# Altium project mezza.PrjPcb
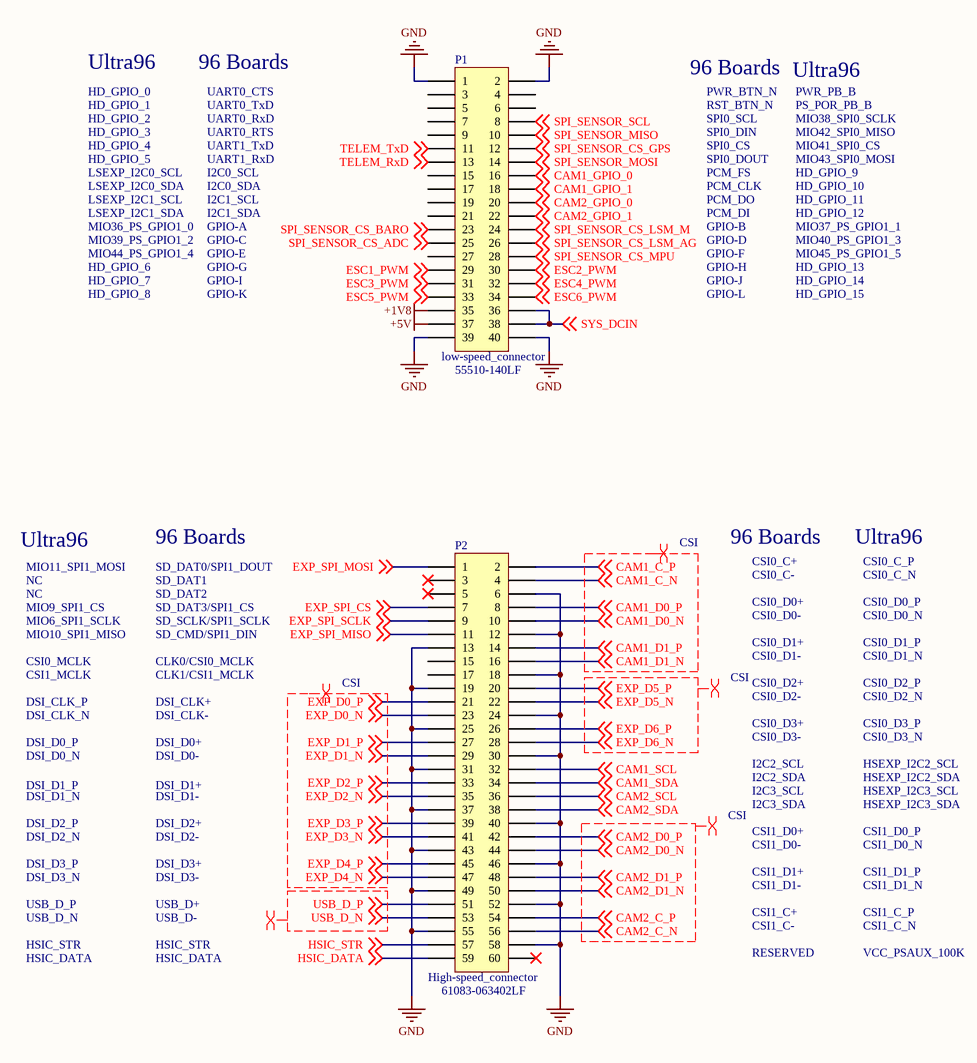
[diagram p0: mezza.SchDoc]
5 sheets, 47 parts. Net scope: flat (ports and power ports of the same name join across sheets).
Board file: mezza.PcbDoc
Sheets:
  mezza.SchDoc
  Camera.SchDoc
  9DOF_Sensors.SchDoc
  GPS.SchDoc
  esc.SchDoc

## Sheet mezza.SchDoc
size A1

### Parts
(Parts that share a designator on the sheet are numbered #1, #2 ... from top to bottom, then left to right.)
P1#1  low-speed_connector  PartNumber: 55510-140LF  [low-speed_connector_SM]
P2#1  High-speed_connector  PartNumber: 61083-063402LF  [high-speed_connector]

### Nets
+1V8: P1#1.35
+5V: P1#1.37
GND: P1#1.1 P1#1.2 P1#1.39 P1#1.40 P2#1.6 P2#1.12 P2#1.13 P2#1.18 P2#1.19 P2#1.24 P2#1.25 P2#1.30 P2#1.31 P2#1.37 P2#1.40 P2#1.43 P2#1.46 P2#1.49 P2#1.52 P2#1.55 P2#1.58
CAM1_C_N: P2#1.4 ; off-sheet CAM1_C_N
CAM1_C_P: P2#1.2 ; off-sheet CAM1_C_P
CAM1_D0_N: P2#1.10 ; off-sheet CAM1_D0_N
CAM1_D0_P: P2#1.8 ; off-sheet CAM1_D0_P
CAM1_D1_N: P2#1.16 ; off-sheet CAM1_D1_N
CAM1_D1_P: P2#1.14 ; off-sheet CAM1_D1_P
CAM1_GPIO_0: P1#1.16 ; off-sheet CAM1_GPIO_0
CAM1_GPIO_1: P1#1.18 ; off-sheet CAM1_GPIO_1
CAM1_SCL: P2#1.32 ; off-sheet CAM1_SCL
CAM1_SDA: P2#1.34 ; off-sheet CAM1_SDA
CAM2_C_N: P2#1.56 ; off-sheet CAM2_C_N
CAM2_C_P: P2#1.54 ; off-sheet CAM2_C_P
CAM2_D0_N: P2#1.44 ; off-sheet CAM2_D0_N
CAM2_D0_P: P2#1.42 ; off-sheet CAM2_D0_P
CAM2_D1_N: P2#1.50 ; off-sheet CAM2_D1_N
CAM2_D1_P: P2#1.48 ; off-sheet CAM2_D1_P
CAM2_GPIO_0: P1#1.20 ; off-sheet CAM2_GPIO_0
CAM2_GPIO_1: P1#1.22 ; off-sheet CAM2_GPIO_1
CAM2_SCL: P2#1.36 ; off-sheet CAM2_SCL
CAM2_SDA: P2#1.38 ; off-sheet CAM2_SDA
ESC1_PWM: P1#1.29 ; off-sheet ESC1_PWM
ESC2_PWM: P1#1.30 ; off-sheet ESC2_PWM
ESC3_PWM: P1#1.31 ; off-sheet ESC3_PWM
ESC4_PWM: P1#1.32 ; off-sheet ESC4_PWM
ESC5_PWM: P1#1.33 ; off-sheet ESC5_PWM
ESC6_PWM: P1#1.34 ; off-sheet ESC6_PWM
EXP_D0_N: P2#1.23 ; off-sheet EXP_D0_N
EXP_D0_P: P2#1.21 ; off-sheet EXP_D0_P
EXP_D1_N: P2#1.29 ; off-sheet EXP_D1_N
EXP_D1_P: P2#1.27 ; off-sheet EXP_D1_P
EXP_D2_N: P2#1.35 ; off-sheet EXP_D2_N
EXP_D2_P: P2#1.33 ; off-sheet EXP_D2_P
EXP_D3_N: P2#1.41 ; off-sheet EXP_D3_N
EXP_D3_P: P2#1.39 ; off-sheet EXP_D3_P
EXP_D4_N: P2#1.47 ; off-sheet EXP_D4_N
EXP_D4_P: P2#1.45 ; off-sheet EXP_D4_P
EXP_D5_N: P2#1.22 ; off-sheet EXP_D5_N
EXP_D5_P: P2#1.20 ; off-sheet EXP_D5_P
EXP_D6_N: P2#1.28 ; off-sheet EXP_D6_N
EXP_D6_P: P2#1.26 ; off-sheet EXP_D6_P
EXP_SPI_CS: P2#1.7 ; off-sheet EXP_SPI_CS
EXP_SPI_MISO: P2#1.11 ; off-sheet EXP_SPI_MISO
EXP_SPI_MOSI: P2#1.1 ; off-sheet EXP_SPI_MOSI
EXP_SPI_SCLK: P2#1.9 ; off-sheet EXP_SPI_SCLK
HSIC_DATA: P2#1.59 ; off-sheet HSIC_DATA
HSIC_STR: P2#1.39(57) ; off-sheet HSIC_STR
SPI_SENSOR_CS_ADC: P1#1.25 ; off-sheet SPI_SENSOR_CS_ADC
SPI_SENSOR_CS_BARO: P1#1.23 ; off-sheet SPI_SENSOR_CS_BARO
SPI_SENSOR_CS_GPS: P1#1.12 ; off-sheet SPI_SENSOR_CS_GPS
SPI_SENSOR_CS_LSM_AG: P1#1.26 ; off-sheet SPI_SENSOR_CS_LSM_AG
SPI_SENSOR_CS_LSM_M: P1#1.24 ; off-sheet SPI_SENSOR_CS_LSM_M
SPI_SENSOR_CS_MPU: P1#1.28 ; off-sheet SPI_SENSOR_CS_MPU
SPI_SENSOR_MISO: P1#1.10 ; off-sheet SPI_SENSOR_MISO
SPI_SENSOR_MOSI: P1#1.14 ; off-sheet SPI_SENSOR_MOSI
SPI_SENSOR_SCL: P1#1.8 ; off-sheet SPI_SENSOR_SCL
SYS_DCIN: P1#1.36 P1#1.38 ; off-sheet SYS_DCIN
TELEM_RxD: P1#1.13 ; off-sheet TELEM_RxD
TELEM_TxD: P1#1.11 ; off-sheet TELEM_TxD
USB_D_N: P2#1.53 ; off-sheet USB_D_N
USB_D_P: P2#1.51 ; off-sheet USB_D_P

Not connected (* = marked no-connect by the designer): P1#1 3 4 5 6 7 9 15 17 19 21 27; P2#1 3* 5* 15 17

### Layout directives
differential pair; rule Differential Pairs Routing [Pref Gap = 0.15mm    Min Gap  = 0.1mm    Max Gap  = 0.254mmPref Width = 0.15mm    Min Width  = 0.1mm    Max Width  = 0.381mm]; differential pair class CSI: CAM1_C_N, CAM1_C_P, CAM1_D0_N, CAM1_D0_P, CAM1_D1_N, CAM1_D1_P, CAM2_C_N, CAM2_C_P, CAM2_D0_N, CAM2_D0_P, CAM2_D1_N, CAM2_D1_P, EXP_D0_N, EXP_D0_P, EXP_D1_N, EXP_D1_P, EXP_D2_N, EXP_D2_P, EXP_D3_N, EXP_D3_P, EXP_D4_N, EXP_D4_P, EXP_D5_N, EXP_D5_P, EXP_D6_N, EXP_D6_P
differential pair: USB_D_N, USB_D_P

### Notes on the sheet
- Ultra96
- 96 Boards
- HD_GPIO_0
- HD_GPIO_1
- HD_GPIO_2
- HD_GPIO_3
- HD_GPIO_4
- UART0_CTS
- UART0_TxD
- UART0_RxD
- UART0_RTS
- UART1_TxD
- PWR_BTN_N
- RST_BTN_N
- SPI0_SCL
- SPI0_DIN
- SPI0_CS
- PWR_PB_B
- PS_POR_PB_B
- MIO38_SPI0_SCLK
- MIO42_SPI0_MISO
- MIO41_SPI0_CS
- HD_GPIO_5
- LSEXP_I2C0_SCL
- LSEXP_I2C0_SDA
- LSEXP_I2C1_SCL
- LSEXP_I2C1_SDA
- UART1_RxD
- I2C0_SCL
- I2C0_SDA
- I2C1_SCL
- I2C1_SDA
- SPI0_DOUT
- PCM_FS
- PCM_CLK
- PCM_DO
- PCM_DI
- MIO43_SPI0_MOSI
- HD_GPIO_9
- HD_GPIO_10
- HD_GPIO_11
- HD_GPIO_12
- MIO36_PS_GPIO1_0
- MIO39_PS_GPIO1_2
- MIO44_PS_GPIO1_4
- HD_GPIO_6
- HD_GPIO_7
- GPIO-A
- GPIO-C
- GPIO-E
- GPIO-G
- GPIO-I
- GPIO-B
- GPIO-D
- GPIO-F
- GPIO-H
- GPIO-J
- MIO37_PS_GPIO1_1
- MIO40_PS_GPIO1_3
- MIO45_PS_GPIO1_5
- HD_GPIO_13
- HD_GPIO_14
- HD_GPIO_8
- GPIO-K
- GPIO-L
- HD_GPIO_15
- MIO11_SPI1_MOSI
- NC
- MIO9_SPI1_CS
- SD_DAT0/SPI1_DOUT
- SD_DAT1
- SD_DAT2
- SD_DAT3/SPI1_CS
- CSI0_C+
- CSI0_C-
- CSI0_D0+
- CSI0_D0-
- CSI0_C_P
- CSI0_C_N
- CSI0_D0_P
- CSI0_D0_N
- MIO6_SPI1_SCLK
- MIO10_SPI1_MISO
- CSI0_MCLK
- CSI1_MCLK
- SD_SCLK/SPI1_SCLK
- SD_CMD/SPI1_DIN
- CLK0/CSI0_MCLK
- CLK1/CSI1_MCLK
- CSI0_D1+
- CSI0_D1-
- CSI0_D2+
- CSI0_D1_P
- CSI0_D1_N
- CSI0_D2_P
- DSI_CLK_P
- DSI_CLK_N
- DSI_D0_P
- DSI_CLK+
- DSI_CLK-
- DSI_D0+
- CSI0_D2-
- CSI0_D3+
- CSI0_D3-
- CSI0_D2_N
- CSI0_D3_P
- CSI0_D3_N
- DSI_D0_N
- DSI_D1_P
- DSI_D1_N
- DSI_D0-
- DSI_D1+
- DSI_D1-
- I2C2_SCL
- I2C2_SDA
- I2C3_SCL
- I2C3_SDA
- HSEXP_I2C2_SCL
- HSEXP_I2C2_SDA
- HSEXP_I2C3_SCL
- HSEXP_I2C3_SDA
- DSI_D2_P
- DSI_D2_N
- DSI_D3_P
- DSI_D3_N
- DSI_D2+
- DSI_D2-
- DSI_D3+
- DSI_D3-
- CSI1_D0+
- CSI1_D0-
- CSI1_D1+
- CSI1_D1-
- CSI1_D0_P
- CSI1_D0_N
- CSI1_D1_P
- CSI1_D1_N
- USB_D_P
- USB_D_N
- HSIC_STR
- USB_D+
- USB_D-
- CSI1_C+
- CSI1_C-
- RESERVED
- CSI1_C_P
- CSI1_C_N
- VCC_PSAUX_100K
- HSIC_DATA

### Library data of the parts
P1#1 = low-speed_connector: Supplier 1: Digi-Key; Supplier Part Number 1: 609-2696-ND
P2#1 = High-speed_connector: Supplier 1: Digi-Key; Supplier Part Number 1: 609-1679-2-ND

## Sheet Camera.SchDoc
size A
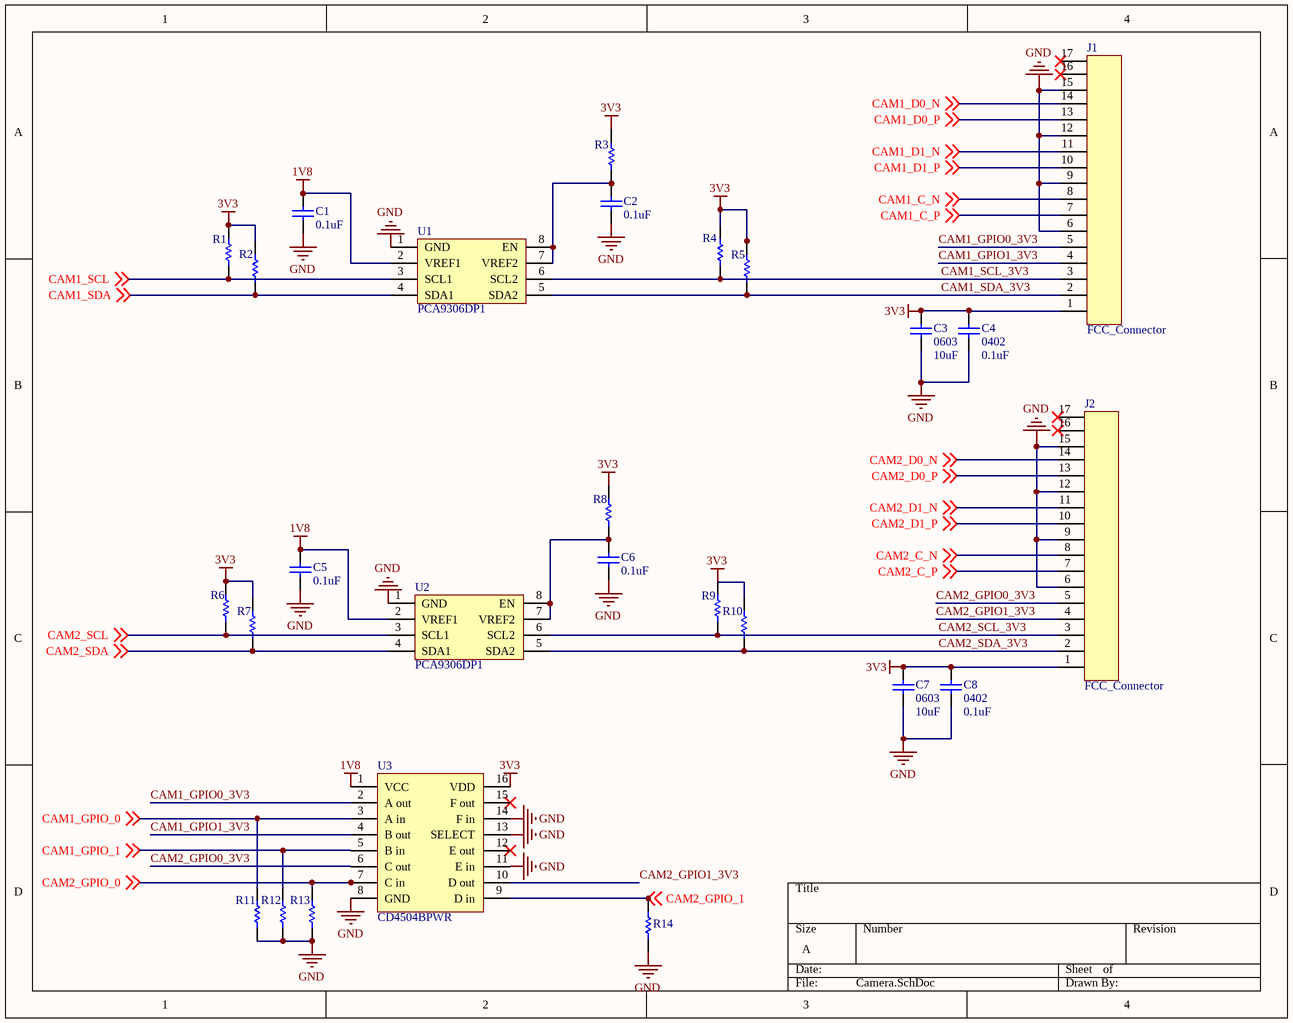
[diagram p1: Camera.SchDoc]

### Parts
C1  value 0.1uF  [0402]  (hidden comment: Cap)
C2  value 0.1uF  [0402]  (hidden comment: Cap)
C3  0603  value 10uF  [1608[0603]]
C4  0402  value 0.1uF  [0402]
C5  value 0.1uF  [0402]  (hidden comment: Cap)
C6  value 0.1uF  [0402]  (hidden comment: Cap)
C7  0603  value 10uF  [1608[0603]]
C8  0402  value 0.1uF  [0402]
J1  FCC_Connector  [CON15_1X15_DRB_S]
J2  FCC_Connector  [CON15_1X15_DRB_S]
R1  Res1  [0402]  (value not drawn)
R2  Res1  [0402]  (value not drawn)
R3  Res1  [0402]  (value not drawn)
R4  Res1  [0402]  (value not drawn)
R5  Res1  [0402]  (value not drawn)
R6  Res1  [0402]  (value not drawn)
R7  Res1  [0402]  (value not drawn)
R8  Res1  [0402]  (value not drawn)
R9  Res1  [0402]  (value not drawn)
R10  Res1  [0402]  (value not drawn)
R11  Res1  [0402]  (value not drawn)
R12  Res1  [0402]  (value not drawn)
R13  Res1  [0402]  (value not drawn)
R14  Res1  [0402]  (value not drawn)
U1  PCA9306DP1  [DCU8]
U2  PCA9306DP1  [DCU8]
U3  CD4504BPWR  [CD4504BPWR_16TSSOP]

### Nets
1V8: C1.2 C5.2 U1.2(VREF1) U2.2(VREF1) U3.1(VCC)
3V3: C3.2 C4.2 C7.2 C8.2 J1.1 J2.1 R1.1 R2.1 R3.1 R4.1 R5.1 R6.1 R7.1 R8.1 R10.1 U3.16(VDD)
GND: C1.1 C2.1 C3.1 C4.1 C5.1 C6.1 C7.1 C8.1 J1.6 J1.9 J1.12 J1.15 J2.6 J2.9 J2.12 J2.15 R11.2 R12.2 R13.2 R14.2 U1.1(GND) U2.1(GND) U3.8(GND) U3.11(E_in) U3.13(SELECT) U3.14(F_in)
CAM1_C_N: J1.8 ; off-sheet CAM1_C_N
CAM1_C_P: J1.7 ; off-sheet CAM1_C_P
CAM1_D0_N: J1.14 ; off-sheet CAM1_D0_N
CAM1_D0_P: J1.13 ; off-sheet CAM1_D0_P
CAM1_D1_N: J1.11 ; off-sheet CAM1_D1_N
CAM1_D1_P: J1.10 ; off-sheet CAM1_D1_P
CAM1_GPIO0_3V3: J1.5 U3.2(A_out)
CAM1_GPIO1_3V3: J1.4 U3.4(B_out)
CAM1_GPIO_0: R11.1 U3.3(A_in) ; off-sheet CAM1_GPIO_0
CAM1_GPIO_1: R12.1 U3.5(B_in) ; off-sheet CAM1_GPIO_1
CAM1_SCL: R1.2 U1.3(SCL1) ; off-sheet CAM1_SCL
CAM1_SCL_3V3: J1.3 R4.2 U1.6(SCL2)
CAM1_SDA: R2.2 U1.4(SDA1) ; off-sheet CAM1_SDA
CAM1_SDA_3V3: J1.2 R5.2 U1.5(SDA2)
CAM2_C_N: J2.8 ; off-sheet CAM2_C_N
CAM2_C_P: J2.7 ; off-sheet CAM2_C_P
CAM2_D0_N: J2.14 ; off-sheet CAM2_D0_N
CAM2_D0_P: J2.13 ; off-sheet CAM2_D0_P
CAM2_D1_N: J2.11 ; off-sheet CAM2_D1_N
CAM2_D1_P: J2.10 ; off-sheet CAM2_D1_P
CAM2_GPIO0_3V3: J2.5 U3.6(C_out)
CAM2_GPIO1_3V3: J2.4 U3.10(D_out)
CAM2_GPIO_0: R13.1 U3.7(C_in) ; off-sheet CAM2_GPIO_0
CAM2_GPIO_1: R14.1 U3.9(D_in) ; off-sheet CAM2_GPIO_1
CAM2_SCL: R6.2 U2.3(SCL1) ; off-sheet CAM2_SCL
CAM2_SCL_3V3: J2.3 R9.2 U2.6(SCL2)
CAM2_SDA: R7.2 U2.4(SDA1) ; off-sheet CAM2_SDA
CAM2_SDA_3V3: J2.2 R10.2 U2.5(SDA2)
NetC2_2: C2.2 R3.2 U1.7(VREF2) U1.8(EN)
NetC6_2: C6.2 R8.2 U2.7(VREF2) U2.8(EN)

Not connected (* = marked no-connect by the designer): J1 16* 17*; J2 16* 17*; R9 1; U3 12(E_out)* 15(F_out)*

### Library data of the parts
C1-C8 = Cap: Capacitor; Published: 8-Jun-2000; LatestRevisionDate: 17-Jul-2002; LatestRevisionNote: Re-released for DXP Platform.; PackageReference: RAD-0.3; Publisher: Altium Limited; PackageDescription: Radial Cap, Thru-Hole; 2 Leads; 0.3 in Pin Spacing
R1-R14 = Res1: Resistor; Published: 8-Jun-2000; LatestRevisionDate: 17-Jul-2002; LatestRevisionNote: Re-released for DXP Platform.; PackageReference: AXIAL-0.3; Publisher: Altium Limited; PackageDescription: Axial Device, Thru-Hole; 2 Leads; 0.3 in Pin Spacing
U1 U2 = PCA9306

## Sheet 9DOF_Sensors.SchDoc
size A
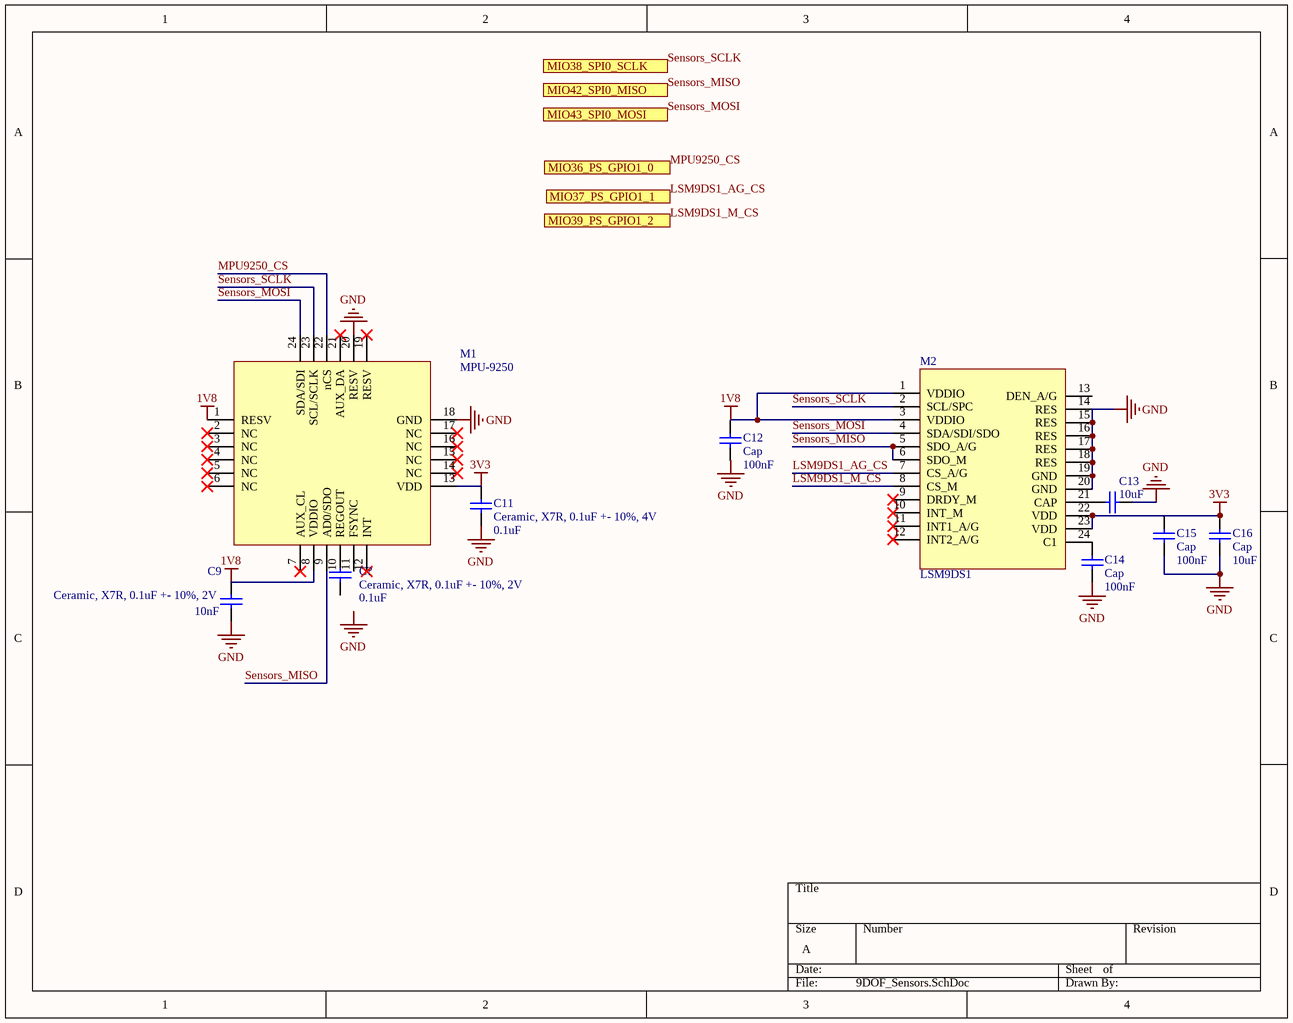
[diagram p2: 9DOF_Sensors.SchDoc]

### Parts
C9  Ceramic, X7R, 0.1uF +- 10%, 2V  value 10nF  [0402]
C11  Ceramic, X7R, 0.1uF +- 10%, 4V  value 0.1uF  [0402]
C12  Cap  value 100nF  [0402]
C13  value 10uF  [0402]  (hidden comment: Cap)
C14  Cap  value 100nF  [0402]
C15  Cap  value 100nF  [0402]
C16  Cap  value 10uF  [0402]
C?  Ceramic, X7R, 0.1uF +- 10%, 2V  value 0.1uF  [0402]
M1  MPU-9250  [MPU-9250]
M2  LSM9DS1  [LSM9DS1]

### Ports
MIO36_PS_GPIO1_0, MIO37_PS_GPIO1_1, MIO38_SPI0_SCLK, MIO39_PS_GPIO1_2, MIO42_SPI0_MISO, MIO43_SPI0_MOSI

### Nets
1V8: C12.1 M1.1(RESV) M1.8(VDDIO) M2.1(VDDIO) M2.3(VDDIO)
3V3: C11.2 C15.2 C16.2 M1.13(VDD) M2.22(VDD) M2.23(VDD)
GND: C9.1 C11.1 C12.2 C13.1 C14.1 C15.1 C16.1 M1.18(GND) M1.20(RESV) M2.14(RES) M2.15(RES) M2.16(RES) M2.17(RES) M2.18(RES) M2.19(GND) M2.20(GND)
LSM9DS1_AG_CS: M2.7(CS_A/G) ; port MIO37_PS_GPIO1_1
LSM9DS1_M_CS: M2.8(CS_M) ; port MIO39_PS_GPIO1_2
MPU9250_CS: M1.22(nCS) ; port MIO36_PS_GPIO1_0
Sensors_MISO: M1.9(AD0/SDO) M2.5(SDO_A/G) M2.6(SDO_M) ; port MIO42_SPI0_MISO
Sensors_MOSI: M1.24(SDA/SDI) M2.4(SDA/SDI/SDO) ; port MIO43_SPI0_MOSI
Sensors_SCLK: M1.23(SCL/SCLK) M2.2(SCL/SPC) ; port MIO38_SPI0_SCLK
NetC13_2: C13.2 M2.21(CAP)
NetC14_2: C14.2 M2.24(C1)

Not connected (* = marked no-connect by the designer): C9 2; C? 1 2; M1 2(NC)* 3(NC)* 4(NC)* 5(NC)* 6(NC)* 7(AUX_CL)* 10(REGOUT) 11(FSYNC) 12(INT)* 14(NC)* 15(NC)* 16(NC)* 17(NC)* 19(RESV)* 21(AUX_DA)*; M2 9(DRDY_M)* 10(INT_M)* 11(INT1_A/G)* 12(INT2_A/G)* 13(DEN_A/G)

### Notes on the sheet
- Labels drawn without touching a wire or pin: GND

### Library data of the parts
C9 C11-C16 C? = Cap: Capacitor; Published: 8-Jun-2000; LatestRevisionDate: 17-Jul-2002; LatestRevisionNote: Re-released for DXP Platform.; PackageReference: RAD-0.3; Publisher: Altium Limited; PackageDescription: Radial Cap, Thru-Hole; 2 Leads; 0.3 in Pin Spacing

## Sheet GPS.SchDoc
size A
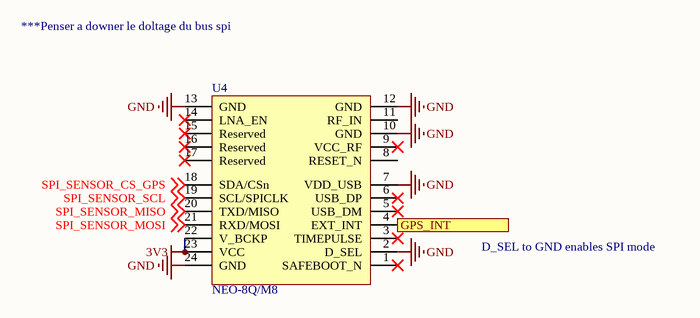
[diagram p3: GPS.SchDoc]

### Parts
U4  NEO-8Q/M8  [NEO-8Q/M8]

### Ports
GPS_INT

### Nets
3V3: U4.22(V_BCKP) U4.23(VCC)
GND: U4.2(D_SEL) U4.7(VDD_USB) U4.10(GND) U4.12(GND) U4.13(GND) U4.24(GND)
SPI_SENSOR_CS_GPS: U4.18(SDA/CSn) ; off-sheet SPI_SENSOR_CS_GPS
SPI_SENSOR_MISO: U4.20(TXD/MISO) ; off-sheet SPI_SENSOR_MISO
SPI_SENSOR_MOSI: U4.21(RXD/MOSI) ; off-sheet SPI_SENSOR_MOSI
SPI_SENSOR_SCL: U4.19(SCL/SPICLK) ; off-sheet SPI_SENSOR_SCL
NetU4_4: U4.4(EXT_INT) ; port GPS_INT

Not connected (* = marked no-connect by the designer): U4 1(SAFEBOOT_N)* 3(TIMEPULSE)* 5(USB_DM)* 6(USB_DP)* 8(RESET_N) 9(VCC_RF)* 11(RF_IN) 14(LNA_EN)* 15(Reserved)* 16(Reserved)* 17(Reserved)*

### Notes on the sheet
- ***Penser a downer le doltage du bus spi
- D_SEL to GND enables SPI mode

## Sheet esc.SchDoc
size A
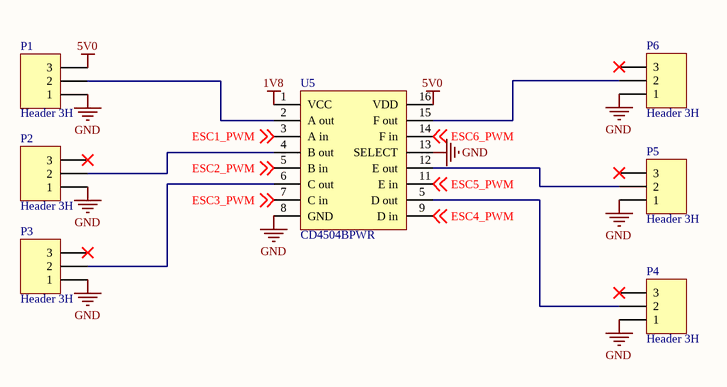
[diagram p4: esc.SchDoc]

### Parts
(Parts that share a designator on the sheet are numbered #1, #2 ... from top to bottom, then left to right.)
P1#2  Header 3H  [HDR1X3H]
P2#2  Header 3H  [HDR1X3H]
P3  Header 3H  [HDR1X3H]
P4  Header 3H  [HDR1X3H]
P5  Header 3H  [HDR1X3H]
P6  Header 3H  [HDR1X3H]
U5  CD4504BPWR  [CD4504BPWR_16TSSOP]

### Nets
1V8: U5.1(VCC)
5V0: P1#2.3 U5.16(VDD)
GND: P1#2.1 P2#2.1 P3.1 P4.1 P5.1 P6.1 U5.8(GND) U5.13(SELECT)
ESC1_PWM: U5.3(A_in) ; off-sheet ESC1_PWM
ESC2_PWM: U5.5(B_in) ; off-sheet ESC2_PWM
ESC3_PWM: U5.7(C_in) ; off-sheet ESC3_PWM
ESC4_PWM: U5.9(D_in) ; off-sheet ESC4_PWM
ESC5_PWM: U5.11(E_in) ; off-sheet ESC5_PWM
ESC6_PWM: U5.14(F_in) ; off-sheet ESC6_PWM
NetP1#2_2: P1#2.2 U5.2(A_out)
NetP2#2_2: P2#2.2 U5.4(B_out)
NetP3_2: P3.2 U5.6(C_out)
NetP4_2: P4.2 U5.5(D_out)
NetP5_2: P5.2 U5.12(E_out)
NetP6_2: P6.2 U5.15(F_out)

Not connected (* = marked no-connect by the designer): P2#2 3*; P3 3*; P4 3*; P5 3*; P6 3*

### Library data of the parts
P1#2 P2#2 P3-P6 = Header 3H: Header, 3-Pin, Right Angle; LatestRevisionDate: 17-Jul-2002; LatestRevisionNote: Re-released for DXP Platform.; Publisher: Altium Limited

## Nets that join several sheets
1V8: Camera (5 pins), 9DOF_Sensors (5 pins), esc (U5.1)
3V3: Camera (16 pins), 9DOF_Sensors (6 pins), GPS (U4.22 U4.23)
GND: mezza (21 pins), Camera (26 pins), 9DOF_Sensors (16 pins), GPS (6 pins), esc (8 pins)
CAM1_C_N: mezza (P2#1.4), Camera (J1.8)
CAM1_C_P: mezza (P2#1.2), Camera (J1.7)
CAM1_D0_N: mezza (P2#1.10), Camera (J1.14)
CAM1_D0_P: mezza (P2#1.8), Camera (J1.13)
CAM1_D1_N: mezza (P2#1.16), Camera (J1.11)
CAM1_D1_P: mezza (P2#1.14), Camera (J1.10)
CAM1_GPIO_0: mezza (P1#1.16), Camera (R11.1 U3.3)
CAM1_GPIO_1: mezza (P1#1.18), Camera (R12.1 U3.5)
CAM1_SCL: mezza (P2#1.32), Camera (R1.2 U1.3)
CAM1_SDA: mezza (P2#1.34), Camera (R2.2 U1.4)
CAM2_C_N: mezza (P2#1.56), Camera (J2.8)
CAM2_C_P: mezza (P2#1.54), Camera (J2.7)
CAM2_D0_N: mezza (P2#1.44), Camera (J2.14)
CAM2_D0_P: mezza (P2#1.42), Camera (J2.13)
CAM2_D1_N: mezza (P2#1.50), Camera (J2.11)
CAM2_D1_P: mezza (P2#1.48), Camera (J2.10)
CAM2_GPIO_0: mezza (P1#1.20), Camera (R13.1 U3.7)
CAM2_GPIO_1: mezza (P1#1.22), Camera (R14.1 U3.9)
CAM2_SCL: mezza (P2#1.36), Camera (R6.2 U2.3)
CAM2_SDA: mezza (P2#1.38), Camera (R7.2 U2.4)
ESC1_PWM: mezza (P1#1.29), esc (U5.3)
ESC2_PWM: mezza (P1#1.30), esc (U5.5)
ESC3_PWM: mezza (P1#1.31), esc (U5.7)
ESC4_PWM: mezza (P1#1.32), esc (U5.9)
ESC5_PWM: mezza (P1#1.33), esc (U5.11)
ESC6_PWM: mezza (P1#1.34), esc (U5.14)
SPI_SENSOR_CS_GPS: mezza (P1#1.12), GPS (U4.18)
SPI_SENSOR_MISO: mezza (P1#1.10), GPS (U4.20)
SPI_SENSOR_MOSI: mezza (P1#1.14), GPS (U4.21)
SPI_SENSOR_SCL: mezza (P1#1.8), GPS (U4.19)